# Altium schematic sheet TOP.SchDoc: =DocumentName
size A4; Organization: Queen's Formula SAE; Address1: 130 Stuart St, Kingston; Address2: Ontario; Address3: Canada; Address4: K7L 2V9; DocumentNumber: 1; Revision: 0; SheetNumber: 1; SheetTotal: 1
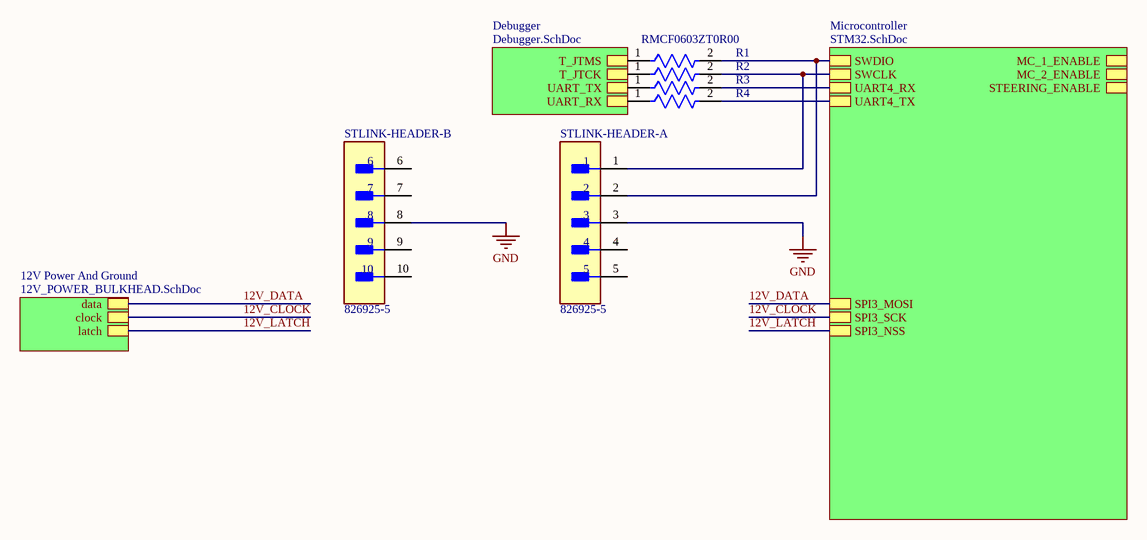
[diagram p0: TOP.SchDoc]

## Parts
R1  RMCF0603ZT0R00  [FP-RMCF0603-MFG]
R2  RMCF0603ZT0R00  [FP-RMCF0603-MFG]  (value not drawn)
R3  RMCF0603ZT0R00  [FP-RMCF0603-MFG]  (value not drawn)
R4  RMCF0603ZT0R00  [FP-RMCF0603-MFG]  (value not drawn)
STLINK-HEADER-  826925-5  [FP-826925-5-MFG]  (parts A,B of 2)

## Sub-sheets
12V Power And Ground = 12V_POWER_BULKHEAD.SchDoc: data, clock, latch
Debugger = Debugger.SchDoc: T_JTCK, T_JTMS, UART_TX, UART_RX
Microcontroller = STM32.SchDoc: SWDIO, SWCLK, UART4_RX, UART4_TX, SPI3_NSS, SPI3_MOSI, SPI3_SCK, MC_1_ENABLE, MC_2_ENABLE, STEERING_ENABLE

## Nets
GND: STLINK-HEADER-.3 STLINK-HEADER-.8
12V_CLOCK: sheet Microcontroller/SPI3_SCK, sheet 12V Power And Ground/clock
12V_DATA: sheet Microcontroller/SPI3_MOSI, sheet 12V Power And Ground/data
12V_LATCH: sheet Microcontroller/SPI3_NSS, sheet 12V Power And Ground/latch
NetR1_1: R1.1 ; sheet Debugger/T_JTMS
NetR1_2: R1.2 STLINK-HEADER-.2 ; sheet Microcontroller/SWDIO
NetR2_1: R2.1 ; sheet Debugger/T_JTCK
NetR2_2: R2.2 STLINK-HEADER-.1 ; sheet Microcontroller/SWCLK
NetR3_1: R3.1 ; sheet Debugger/UART_TX
NetR3_2: R3.2 ; sheet Microcontroller/UART4_RX
NetR4_1: R4.1 ; sheet Debugger/UART_RX
NetR4_2: R4.2 ; sheet Microcontroller/UART4_TX

Not connected (* = marked no-connect by the designer): STLINK-HEADER- 4 5 6 7 9 10

## Notes on the sheet
- Title
- Size:
- Date:
- A4
- Number:
- Time:
- Revision:
- Sheet
- of
- File:

## Library data of the parts
R1-R4 = CMP-26527-000011-1: RES 0 OHM JUMPER 1/10W 0603; Manufacturer: Stackpole; Power Rating: 0.1W; Voltage Rating: 75V; Resistance: 0mΩ; Automotive Grade: Grade 0; Value: 0mΩ; Series: RMCF; Manufacturer Part Number: RMCF0603ZT0R00; Device Class L1: Passive Components; Device Class L3: Chip SMD Resistors; Octopart: https://octopart.com/rmcf0603zt0r00-stackpole+electronics-19213618; Temperature: -55°C to +155°C; Lead Free: Yes; ComponentLink2URL: https://www.seielect.com/catalog/sei-rmcf_rmcp.pdf; Height: 0.55mm; Composition: Thick Film; Package: RMCF0603; Automotive: Yes; Temperature Range High: +155°C; Ipc Land Pattern Name: RESC15580X45; Digikey Description: RES 0 OHM JUMPER 1/10W 0603; RoHS: TRUE; ComponentLink2Description: Datasheet; Temperature Range Low: -55°C; Category: Res; Device Class L2: Resistors
STLINK-HEADER- = CMP-03369-000006-1: CONN HEADER VERT 10POS 2.54MM; Manufacturer: TE Connectivity; Conn Orientation: Vertical; Standoff Height: 0.3mm; Number Of Contacts: 10; Current Rating: 5A; Conn Gender: Male; Number Of Rows: 2; Category: Conn; Octopart: https://octopart.com/826925-5-te+connectivity-41836231; Lead Free: Yes; Height: 9.9mm; ComponentLink2Description: Datasheet; Temperature Range High: +105°C; Pitch: 2.54mm; Manufacturer Part Number: 826925-5; Automotive: No; Digikey Description: CONN HEADER VERT 10POS 2.54MM; ComponentLink2URL: https://www.te.com/commerce/DocumentDelivery/DDEController?Action=showdoc&DocId=Customer+Drawing%7F826629%7FAC%7Fpdf%7FEnglish%7FENG_CD_826629_AC.pdf%7F826925-5; Temperature: -65°C to +105°C; RoHS: TRUE; Package: 826925-5; Contact Material: Tin,Nickel; Mouser Description: Headers & Wire Housings 2X05 POS VERT TIN; Device Class L2: Headers and Wire Housings; Device Class L3: unset; Device Class L1: Connectors; Temperature Range Low: -65°C